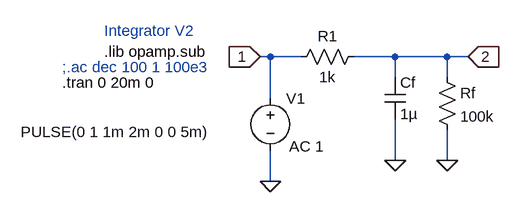
[diagram p0: schematic integrator_v2.asc]
integrator_v2.asc, the LTspice schematic file:
Version 4
SHEET 1 880 680
WIRE -16 80 -32 80
WIRE 32 80 -16 80
WIRE 176 80 112 80
WIRE 256 80 176 80
WIRE 288 80 256 80
WIRE 176 112 176 80
WIRE 256 112 256 80
WIRE -16 144 -16 80
WIRE 176 240 176 176
WIRE 256 240 256 192
WIRE -16 272 -16 224
FLAG 256 240 0
FLAG -16 272 0
FLAG -32 80 1
IOPIN -32 80 In
FLAG 288 80 2
IOPIN 288 80 In
FLAG 176 240 0
SYMBOL voltage -16 128 R0
WINDOW 123 29 90 Left 2
WINDOW 39 0 0 Left 0
WINDOW 3 -384 68 Left 2
SYMATTR Value2 AC 1
SYMATTR Value PULSE(0 1 1m 2m 0 0 5m)
SYMATTR InstName V1
SYMBOL res 128 64 R90
WINDOW 0 0 56 VBottom 2
WINDOW 3 32 56 VTop 2
SYMATTR InstName R1
SYMATTR Value 1k
SYMBOL res 240 96 R0
SYMATTR InstName Rf
SYMATTR Value 100k
SYMBOL cap 160 112 R0
SYMATTR InstName Cf
SYMATTR Value 1µ
TEXT -272 72 Left 2 !.lib opamp.sub
TEXT -336 96 Left 2 ;;.ac dec 100 1 100e3
TEXT -272 40 Left 2 ;Integrator V2
TEXT -336 120 Left 2 !.tran 0 20m 0

The netlist it stands for:
* integrator_v2.asc
V1 1 0 PULSE(0 1 1m 2m 0 0 5m) AC 1
R1 2 1 1k
Rf 2 0 100k
Cf 2 0 1µ
.lib opamp.sub
* ;.ac dec 100 1 100e3
* Integrator V2
.tran 0 20m 0
.backanno
.end